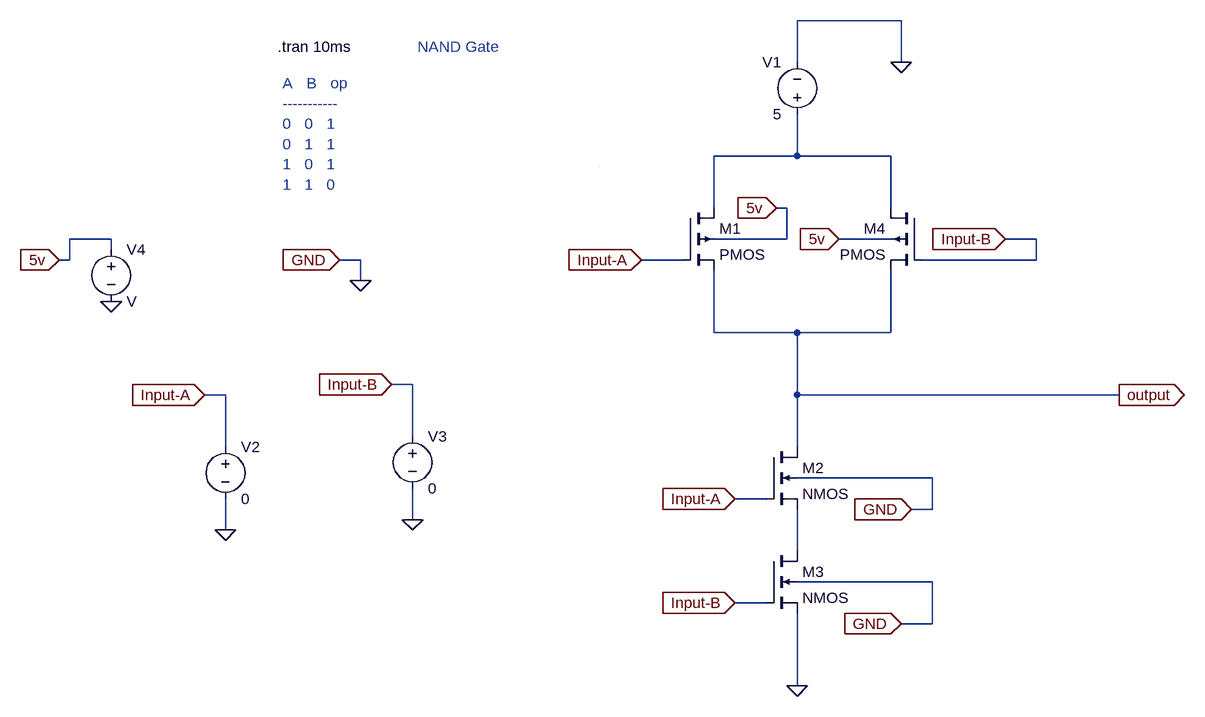
[diagram p0: schematic 2_NAND_gate.asc]
2_NAND_gate.asc, the LTspice schematic file:
Version 4.1
SHEET 1 936 820
WIRE 464 -224 304 -224
WIRE 304 -160 304 -224
WIRE 464 -160 464 -224
WIRE 304 -16 304 -80
WIRE 304 -16 176 -16
WIRE 448 -16 304 -16
WIRE 176 64 176 -16
WIRE 288 64 272 64
WIRE 448 64 448 -16
WIRE -752 112 -816 112
WIRE 288 112 288 64
WIRE 288 112 176 112
WIRE 448 112 368 112
WIRE 672 112 624 112
WIRE -752 128 -752 112
WIRE -816 144 -816 112
WIRE -816 144 -832 144
WIRE -368 144 -400 144
WIRE 128 144 64 144
WIRE 672 144 672 112
WIRE 672 144 496 144
WIRE -368 176 -368 144
WIRE 176 256 176 160
WIRE 304 256 176 256
WIRE 448 256 448 160
WIRE 448 256 304 256
WIRE -288 336 -320 336
WIRE -576 352 -608 352
WIRE 304 352 304 256
WIRE 800 352 304 352
WIRE -288 416 -288 336
WIRE -576 432 -576 352
WIRE 304 432 304 352
WIRE 512 480 304 480
WIRE 256 512 208 512
WIRE 512 528 512 480
WIRE 512 528 480 528
WIRE -288 544 -288 496
WIRE -576 560 -576 512
WIRE 304 592 304 528
WIRE 512 640 304 640
WIRE 256 672 208 672
WIRE 512 704 512 640
WIRE 512 704 464 704
WIRE 304 800 304 688
WIRE 0 0 0 0
FLAG 800 352 output
IOPIN 800 352 Out
FLAG 464 -160 0
FLAG 304 800 0
FLAG 64 144 Input-A
IOPIN 64 144 In
FLAG 208 512 Input-A
IOPIN 208 512 In
FLAG 208 672 Input-B
IOPIN 208 672 In
FLAG 624 112 Input-B
IOPIN 624 112 In
FLAG -576 560 0
FLAG -608 352 Input-A
IOPIN -608 352 In
FLAG -288 544 0
FLAG -320 336 Input-B
IOPIN -320 336 In
FLAG -400 144 GND
IOPIN -400 144 In
FLAG -368 176 0
FLAG -752 208 0
FLAG -832 144 5v
IOPIN -832 144 In
FLAG 480 528 GND
IOPIN 480 528 In
FLAG 464 704 GND
IOPIN 464 704 In
FLAG 368 112 5v
IOPIN 368 112 In
FLAG 272 64 5v
IOPIN 272 64 In
SYMBOL pmos4 128 64 R0
SYMATTR InstName M1
SYMBOL nmos4 256 432 R0
SYMATTR InstName M2
SYMBOL nmos4 256 592 R0
SYMATTR InstName M3
SYMBOL pmos4 496 64 M0
SYMATTR InstName M4
SYMBOL voltage 304 -64 R180
WINDOW 0 24 96 Left 2
WINDOW 3 24 16 Left 2
WINDOW 123 0 0 Left 0
WINDOW 39 0 0 Left 0
SYMATTR InstName V1
SYMATTR Value 5
SYMBOL voltage -576 416 R0
WINDOW 123 0 0 Left 0
WINDOW 39 0 0 Left 0
SYMATTR InstName V2
SYMATTR Value 0
SYMBOL voltage -288 400 R0
WINDOW 123 0 0 Left 0
WINDOW 39 0 0 Left 0
SYMATTR InstName V3
SYMATTR Value 0
SYMBOL voltage -752 112 R0
SYMATTR InstName V4
TEXT -496 -184 Left 2 !.tran 10ms
TEXT -280 -184 Left 2 ;NAND Gate
TEXT -488 -128 Left 2 ;A   B   op\n-----------\n0   0   1\n0   1   1\n1   0   1\n1   1   0

The netlist it stands for:
* 2_NAND_gate.asc
M1 N001 Input-A output 5v PMOS
M2 output Input-A N002 0 NMOS
M3 N002 Input-B 0 0 NMOS
M4 N001 Input-B output 5v PMOS
V1 N001 0 5
V2 Input-A 0 0
V3 Input-B 0 0
V4 5v 0 V
.model NMOS NMOS
.model PMOS PMOS
.lib standard.mos
.tran 10ms
* NAND Gate
* A   B   op
* -----------
* 0   0   1
* 0   1   1
* 1   0   1
* 1   1   0
.backanno
.end